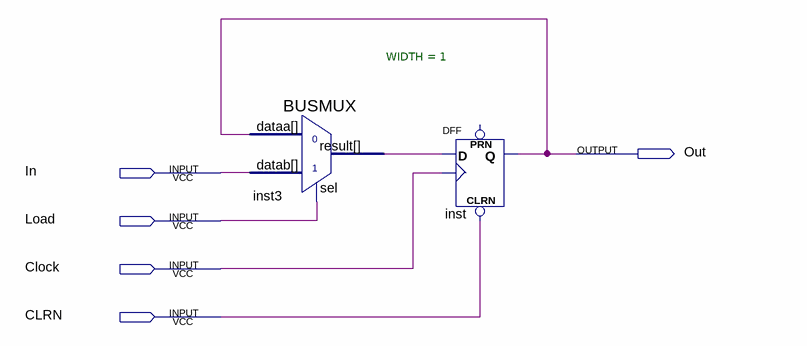
[diagram p0: schematic sheet]
// Quartus schematic register.bdf as structural Verilog: 2 symbols, 5 pins
module register (
  input  In,
  input  Load,
  input  Clock,
  input  CLRN,
  output Out
);

  wire inst3_result;

  BUSMUX #(.WIDTH(1)) inst3 (.datab(In), .sel(Load), .dataa(Out), .result(inst3_result));
  DFF inst (.CLRN(CLRN), .CLK(Clock), .D(inst3_result), .Q(Out));  // open: PRN
endmodule
